# Altium project BottomBoard.PrjPcb
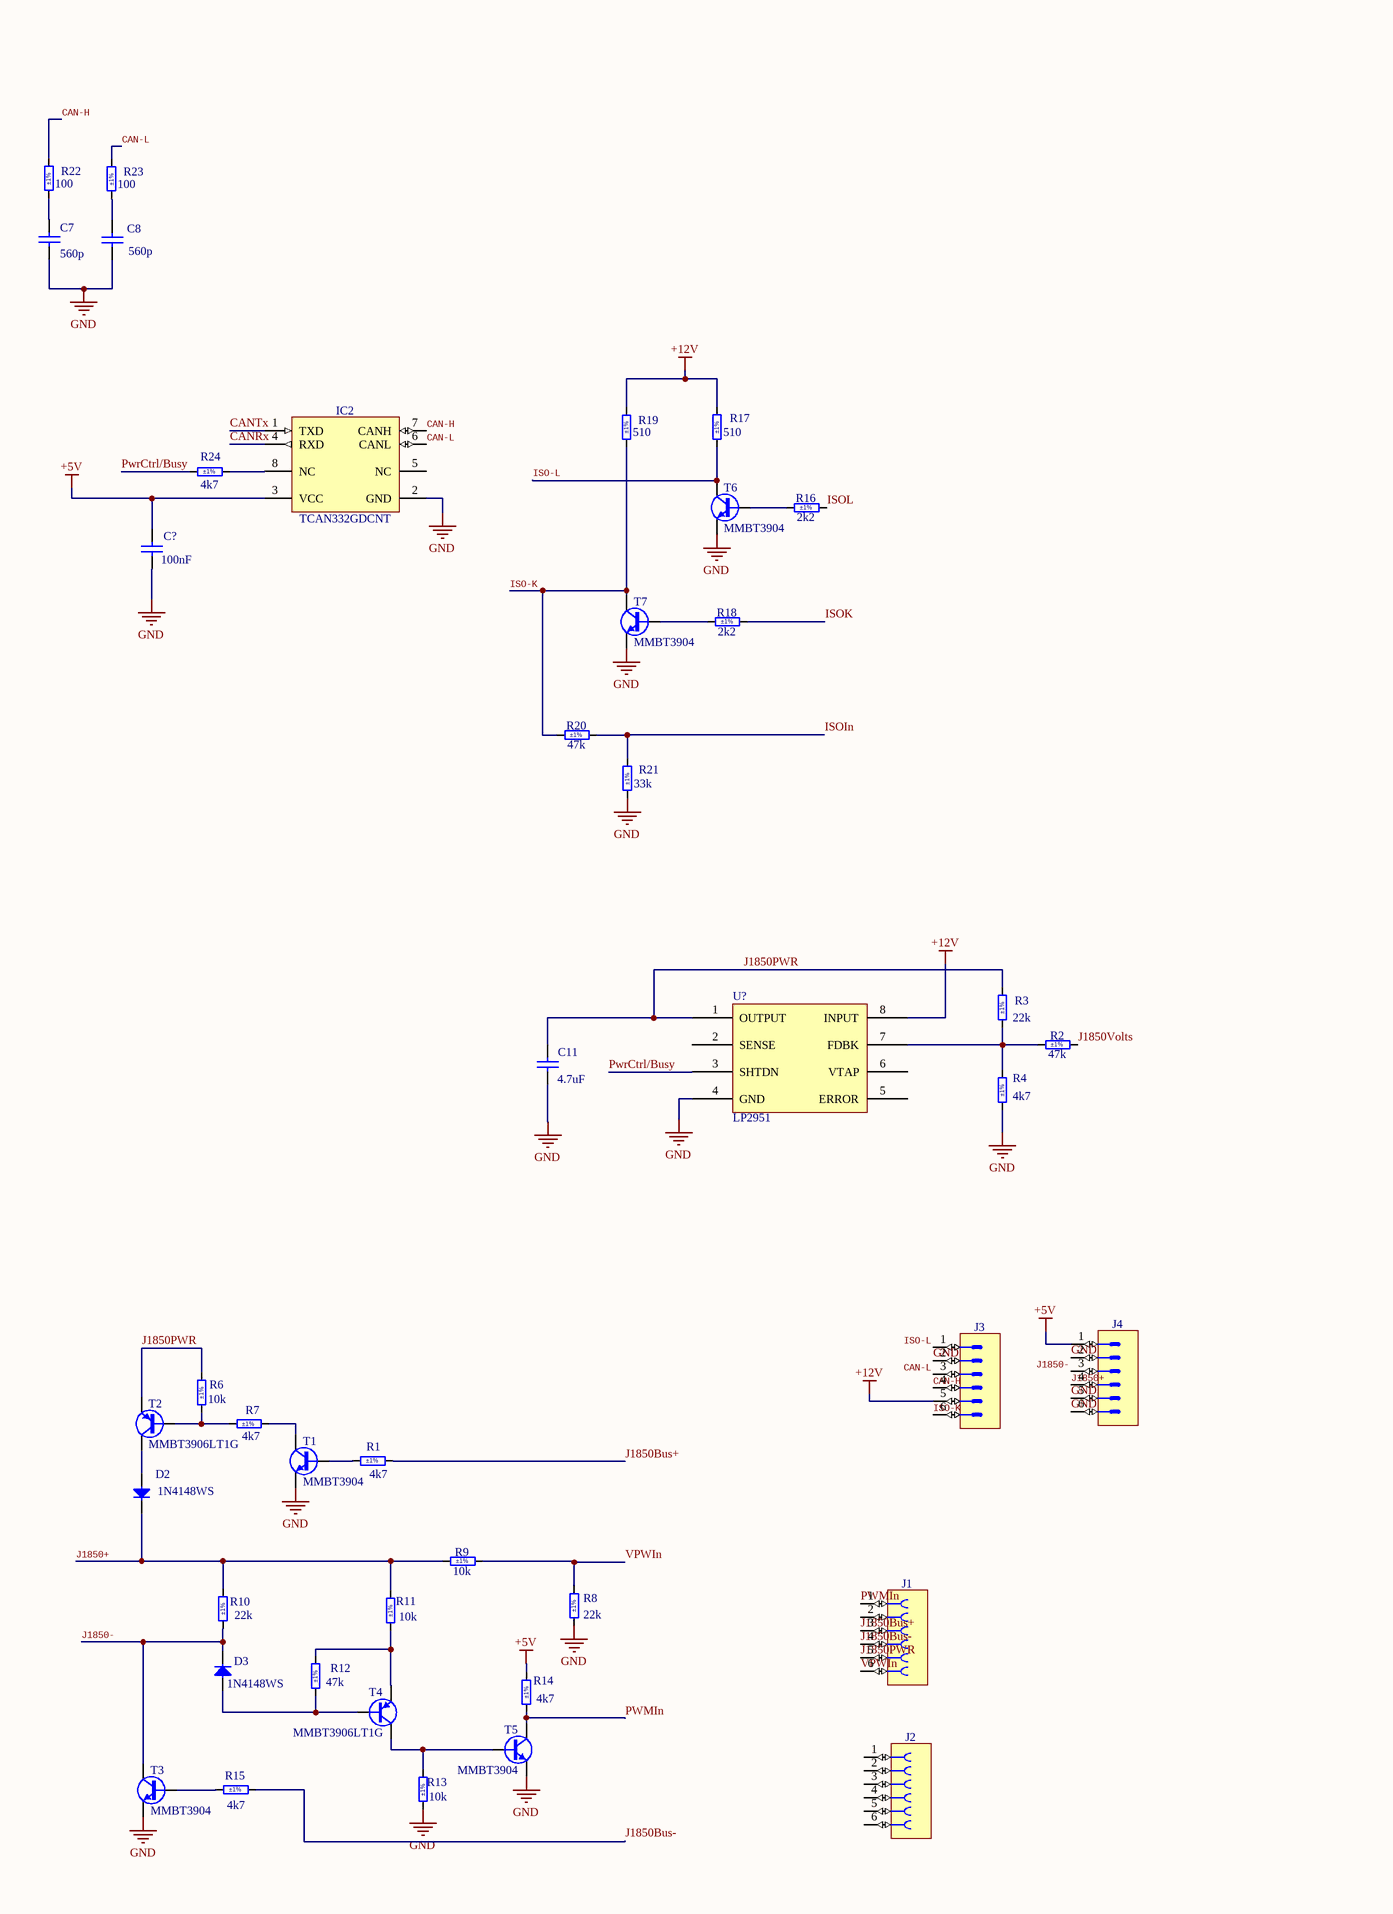
[diagram p0: BottomBoard.SchDoc]
2 sheets, 57 parts. Net scope: global (net labels, ports and power ports of the same name join across sheets).
Board file: BottomBoard.PcbDoc
Sheets:
  BottomBoard.SchDoc
  CPU.SchDoc

## Sheet BottomBoard.SchDoc
size 260 x 358 mm; Origin: Eagle; OriginPath: C:\Users\Bimbo\Downloads\ELM327-based OBD-II interface.sch; OriginSheet: 1

### Parts
(Parts that share a designator on the sheet are numbered #1, #2 ... from top to bottom, then left to right.)
C7  560p  [CAPC2012X135N]
C8  560p  [CAPC2012X135N]
C11  4.7uF  [CAPC2012X145N]
C?#1  100nF  [CAPC2012X135N]
D2  1N4148WS  [SODFL2512X100N]
D3  1N4148WS  [SODFL2512X100N]
IC2  TCAN332GDCNT  [SOT65P280X145-8N]
J1  Socket 6  [3M_929974-01-06-RK]  (value not drawn)
J2  Socket 6  [3M_929974-01-06-RK]  (value not drawn)
J3  Header 6  [3M_961106-6404-AR]  (value not drawn)
J4  Header 6  [3M_961106-6404-AR]  (value not drawn)
R1  4k7  Tolerance: ±1%  [RESC2012X60N]
R2  47k  Tolerance: ±1%  [RESC2012X60N]
R3  22k  Tolerance: ±1%  [RESC2012X60N]
R4  4k7  Tolerance: ±1%  [RESC2012X60N]
R6  10k  Tolerance: ±1%  [RESC2012X60N]
R7  4k7  Tolerance: ±1%  [RESC2012X60N]
R8  22k  Tolerance: ±1%  [RESC2012X60N]
R9  10k  Tolerance: ±1%  [RESC2012X60N]
R10  22k  Tolerance: ±1%  [RESC2012X60N]
R11  10k  Tolerance: ±1%  [RESC2012X60N]
R12  47k  Tolerance: ±1%  [RESC2012X60N]
R13  10k  Tolerance: ±1%  [RESC2012X60N]
R14  4k7  Tolerance: ±1%  [RESC2012X60N]
R15  4k7  Tolerance: ±1%  [RESC2012X60N]
R16  2k2  Tolerance: ±1%  [RESC2012X60N]
R17  510  Tolerance: ±1%  [RESC2012X60N]
R18  2k2  Tolerance: ±1%  [RESC2012X60N]
R19  510  Tolerance: ±1%  [RESC2012X60N]
R20  47k  Tolerance: ±1%  [RESC2012X60N]
R21  33k  Tolerance: ±1%  [RESC2012X60N]
R22  100  Tolerance: ±1%  [RESC2012X60N]
R23  100  Tolerance: ±1%  [RESC2012X60N]
R24  4k7  Tolerance: ±1%  [RESC2012X60N]
T1  MMBT3904  [SOT95P230X110-3N]
T2  MMBT3906LT1G  [SOT95P240X110-3N]
T3  MMBT3904  [SOT95P230X110-3N]
T4  MMBT3906LT1G  [SOT95P240X110-3N]
T5  MMBT3904  [SOT95P230X110-3N]
T6  MMBT3904  [SOT95P230X110-3N]
T7  MMBT3904  [SOT95P230X110-3N]
U?#1  LP2951  [25Q64]

### Nets
+5V: C?#1.2 IC2.3(VCC) J4.1 R14.2
+12V: J3.5 R17.2 R19.2 U?#1.8(INPUT)
GND: C7.1 C8.1 C11.1 C?#1.1 IC2.2(GND) J3.2 J4.2 J4.5 J4.6 R4.1 R8.1 R13.1 R21.1 T1.2(E) T3.2(E) T5.2(E) T6.2(E) T7.2(E) U?#1.4(GND)
CAN-H: IC2.7(CANH) J3.4 R22.2
CAN-L: IC2.6(CANL) J3.3 R23.2
CANRx: IC2.4(RXD)
CANTx: IC2.1(TXD)
ISO-K: J3.6 R19.1 R20.1 T7.3(C)
ISO-L: J3.1 R17.1 T6.3(C)
ISOIn: R20.2 R21.2
ISOK: R18.2
ISOL: R16.2
J1850+: D2.1(C) J4.4 R9.1 R10.2 R11.2
J1850-: D3.1(C) J4.3 R10.1 T3.3(C)
J1850Bus+: J1.3 R1.2
J1850Bus-: J1.4 R15.2
J1850PWR: C11.2 J1.5 R3.2 R6.2 T2.2(E) U?#1.1(OUTPUT)
J1850Volts: R2.2
PWMIn: J1.1 R14.1 T5.3(C)
PwrCtrl/Busy: R24.2 U?#1.3(SHTDN)
VPWIn: J1.6 R8.2 R9.2
NetC7_2: C7.2 R22.1
NetC8_2: C8.2 R23.1
NetD2_2: D2.2(A) T2.3(C)
NetD3_2: D3.2(A) R12.1 T4.1(B)
NetIC2_8: IC2.8(NC) R24.1
NetR1_1: R1.1 T1.1(B)
NetR2_1: R2.1 R3.1 R4.2 U?#1.7(FDBK)
NetR6_1: R6.1 R7.2 T2.1(B)
NetR7_1: R7.1 T1.3(C)
NetR11_1: R11.1 R12.2 T4.2(E)
NetR13_2: R13.2 T4.3(C) T5.1(B)
NetR15_1: R15.1 T3.1(B)
NetR16_1: R16.1 T6.1(B)
NetR18_1: R18.1 T7.1(B)

Not connected (* = marked no-connect by the designer): IC2 5(NC); J1 2; J2 1 2 3 4 5 6; U?#1 2(SENSE) 5(ERROR) 6(VTAP)

### Library data of the parts
C7 C8 C?#1 = CC0805_100NF_50V_10%_X7R: Non-polarised capacitor; Part Description: SMD Multilayer Chip Ceramic Capacitor; Manufacturer: GENERIC; Manufacturer1 Part Number: C2012X7R1H104K085; Voltage: 50V; TC: X7R; Tolerance: ±10%; Part Number: CC0805_100NF_50V_10%_X7R; Component Kind: Standard; Component Type: Standard; Pin Count: 2; Status: Preferred; Manufacturer Part Number: CC0805_100NF_50V_10%_X7R; Case: 0805; Mounted: Yes; Socket: No; SMD: Yes; Sense: No; Manufacturer1 Example: TDK; Manufacturer1 ComponentHeight: 1mm; HelpURL: \\cern.ch\dfs\Applications\Altium\Datasheets\CC0805_X7R_TDK_C.pdf; Author: CERN DEM JLC; CreateDate: 03.12.2007; LatestRevisionDate: 22.04.2015
  C7 C8: Value: 560p
  C?#1: Value: 100nF
C11 = CC0805_4.7UF_50V_10%_X7R: Non-polarised capacitor; Part Description: SMD Multilayer Chip Ceramic Capacitor; Manufacturer: GENERIC; Manufacturer1 Part Number: C2012X7R1H475K125; Voltage: 50V; TC: X7R; Tolerance: ±10%; Part Number: CC0805_4.7UF_50V_10%_X7R; Component Kind: Standard; Component Type: Standard; Pin Count: 2; Value: 4.7uF; Status: Preferred; Manufacturer Part Number: CC0805_4.7UF_50V_10%_X7R; Case: 0805; Mounted: Yes; Socket: No; SMD: Yes; Sense: No; Manufacturer1 Example: TDK; Manufacturer1 ComponentHeight: 1.45mm; HelpURL: \\cern.ch\dfs\Applications\Altium\Datasheets\CC0805_X7R_TDK_C.pdf; Author: CERN DEM JMW; CreateDate: 30.07.2021; LatestRevisionDate: 30.07.2021
D2 D3 = 1N4148WS: Diode; Part Description: Small Signal Diodes; Manufacturer: FAIRCHILD SEMICONDUCTOR; Voltage: 75V; Power: 150mA; PressFit: No; Bonding: No; Part Number: 1N4148WS; Component Kind: Standard; Component Type: Standard; Device: 1N4148WS; PackageDescription: SODFL Diode (SOD323F); 1.70mm W X 1.25mm L X 1.00mm H body, IPC Medium Density; Manufacturer Part Number: 1N4148WS; Pin Count: 2; Case: SOD-323F; Mounted: Yes; Socket: No; SMD: Yes; Sense: No; ComponentHeight: 1mm; HelpURL: \\cern.ch\dfs\Applications\Altium\Datasheets\1N4148WS.pdf; Author: CERN DEM JLC; CreateDate: 12.05.2011; LatestRevisionDate: 12.05.2011
IC2 = TCAN332GDCNT: 3.3V CAN Transceivers with CAN FD (Flexible Data Rate); Manufacturer: TEXAS INSTRUMENTS; PressFit: No; Bonding: No; Part Number: TCAN332GDCNT; Component Kind: Standard; Component Type: Standard; Device: TCAN332GDCNT; PackageDescription: SOT, 0.65mm Pitch; 8 pin, 1.625mm W X 2.90mm L X 1.45mm H body, IPC Medium Density; Part Description: 3.3V CAN Transceivers with CAN FD (Flexible Data Rate); Manufacturer Part Number: TCAN332GDCNT; Pin Count: 8; Case: SOT23-8; Mounted: Yes; Socket: No; SMD: Yes; Sense: No; ComponentHeight: 1.45mm; Author: CERN DEM JLC; HelpURL: \\cern.ch\dfs\Applications\Altium\Datasheets\TCAN332GDCNT.pdf; CreateDate: 22.08.2017; LatestRevisionDate: 22.08.2017
J1 J2 = 3M_929974-01-06-RK: Connector 6 Female; Part Description: 6 Contacts, Straight .100" x .100" Boardmount Socket, 929 Series; Manufacturer: 3M; PressFit: No; Part Number: 3M_929974-01-06-RK; Component Kind: Standard; Component Type: Standard; Pin Count: 6; Family: Socket 6; Mounted: Yes; Socket: No; SMD: No; Sense: No; Status: None; Manufacturer Part Number: 929974-01-06-RK; ComponentHeight: 8.26mm; HelpURL: \\cern.ch\dfs\Applications\Altium\Datasheets\3M_929974-01-06-RK.pdf; Author: CERN DEM JMW; CreateDate: 31.08.2016; LatestRevisionDate: 31.08.2016
J3 J4 = 3M_961106-6404-AR: Connector 6 Male; Part Description: 6 Contacts, Straight .100" x .100" Pin Strip Header, 961 Series; Manufacturer: 3M; PressFit: No; Part Number: 3M_961106-6404-AR; Component Kind: Standard; Component Type: Standard; Pin Count: 6; Family: Header 6; Mounted: Yes; Socket: No; SMD: No; Sense: No; Status: None; Manufacturer Part Number: 961106-6404-AR; ComponentHeight: 8mm; HelpURL: \\cern.ch\dfs\Applications\Altium\Datasheets\3M_961106-6404-AR.pdf; Author: CERN DEM MR; CreateDate: 05.09.2016; LatestRevisionDate: 05.09.2016
R1 R4 R7 R12 R14 R15 R24 = R0805_4K7_1%_0.125W_100PPM: Resistor - 1%; Part Description: General Purpose Thick Film Chip Resistor; Manufacturer: GENERIC; Manufacturer1 Part Number: NRC10F4701TRF; Power: 0.125W; TC: ±100ppm/°C; PressFit: No; Part Number: R0805_4K7_1%_0.125W_100PPM; Component Kind: Standard; Component Type: Standard; Pin Count: 2; Status: Preferred; Manufacturer Part Number: R0805_4K7_1%_0.125W_100PPM; Case: 0805; Mounted: Yes; Sense: No; Socket: No; SMD: Yes; Manufacturer1 Example: NIC COMPONENT; Manufacturer1 ComponentHeight: 0.6mm; HelpURL: \\cern.ch\dfs\Applications\Altium\Datasheets\R0805_NIC_NRC.pdf; Author: CERN DEM JLC; CreateDate: 03.12.2007; LatestRevisionDate: 13.03.2008
  R1 R4 R7 R14 R15 R24: Value: 4k7
  R12: Value: 47k
R2 = R0805_47K_1%_0.125W_100PPM: Resistor - 1%; Part Description: General Purpose Thick Film Chip Resistor; Manufacturer: GENERIC; Manufacturer1 Part Number: NRC10F4702TRF; Power: 0.125W; TC: ±100ppm/°C; PressFit: No; Part Number: R0805_47K_1%_0.125W_100PPM; Component Kind: Standard; Component Type: Standard; Pin Count: 2; Value: 47k; Status: Preferred; Manufacturer Part Number: R0805_47K_1%_0.125W_100PPM; Case: 0805; Mounted: Yes; Sense: No; Socket: No; SMD: Yes; Manufacturer1 Example: NIC COMPONENT; Manufacturer1 ComponentHeight: 0.6mm; HelpURL: \\cern.ch\dfs\Applications\Altium\Datasheets\R0805_NIC_NRC.pdf; Author: CERN DEM JLC; CreateDate: 03.12.2007; LatestRevisionDate: 13.03.2008
R3 = R0805_22K_1%_0.125W_100PPM: Resistor - 1%; Part Description: General Purpose Thick Film Chip Resistor; Manufacturer: GENERIC; Manufacturer1 Part Number: NRC10F2202TRF; Power: 0.125W; TC: ±100ppm/°C; PressFit: No; Part Number: R0805_22K_1%_0.125W_100PPM; Component Kind: Standard; Component Type: Standard; Pin Count: 2; Value: 22k; Status: Preferred; Manufacturer Part Number: R0805_22K_1%_0.125W_100PPM; Case: 0805; Mounted: Yes; Sense: No; Socket: No; SMD: Yes; Manufacturer1 Example: NIC COMPONENT; Manufacturer1 ComponentHeight: 0.6mm; HelpURL: \\cern.ch\dfs\Applications\Altium\Datasheets\R0805_NIC_NRC.pdf; Author: CERN DEM JLC; CreateDate: 03.12.2007; LatestRevisionDate: 13.03.2008
R6 R9 R11 R13 = R0805_10K_1%_0.125W_100PPM: Resistor - 1%; Part Description: General Purpose Thick Film Chip Resistor; Manufacturer: GENERIC; Manufacturer1 Part Number: NRC10F1002TRF; Power: 0.125W; TC: ±100ppm/°C; PressFit: No; Part Number: R0805_10K_1%_0.125W_100PPM; Component Kind: Standard; Component Type: Standard; Pin Count: 2; Value: 10k; Status: Preferred; Manufacturer Part Number: R0805_10K_1%_0.125W_100PPM; Case: 0805; Mounted: Yes; Sense: No; Socket: No; SMD: Yes; Manufacturer1 Example: NIC COMPONENT; Manufacturer1 ComponentHeight: 0.6mm; HelpURL: \\cern.ch\dfs\Applications\Altium\Datasheets\R0805_NIC_NRC.pdf; Author: CERN DEM JLC; CreateDate: 03.12.2007; LatestRevisionDate: 13.03.2008
R8 R10 R16-R23 = R0805_2K2_1%_0.125W_100PPM: Resistor - 1%; Part Description: General Purpose Thick Film Chip Resistor; Manufacturer: GENERIC; Manufacturer1 Part Number: NRC10F2201TRF; Power: 0.125W; TC: ±100ppm/°C; PressFit: No; Part Number: R0805_2K2_1%_0.125W_100PPM; Component Kind: Standard; Component Type: Standard; Pin Count: 2; Status: Preferred; Manufacturer Part Number: R0805_2K2_1%_0.125W_100PPM; Case: 0805; Mounted: Yes; Sense: No; Socket: No; SMD: Yes; Manufacturer1 Example: NIC COMPONENT; Manufacturer1 ComponentHeight: 0.6mm; HelpURL: \\cern.ch\dfs\Applications\Altium\Datasheets\R0805_NIC_NRC.pdf; Author: CERN DEM JLC; CreateDate: 03.12.2007; LatestRevisionDate: 13.03.2008
  R8 R10: Value: 22k
  R16 R18: Value: 2k2
  R17 R19: Value: 510
  R20: Value: 47k
  R21: Value: 33k
  R22 R23: Value: 100
T1 T3 T5-T7 = MMBT3904: NPN Transistor; Part Description: 40V 200mA NPN Switching Transistor; Manufacturer: NEXPERIA; PressFit: No; Bonding: No; Part Number: MMBT3904; Component Kind: Standard; Component Type: Standard; Device: MMBT3904; PackageDescription: SOT23, 0.95mm Pitch; 3 Pin, 1.30mm W X 2.90mm L X 1.10mm H body, IPC Medium Density; Manufacturer Part Number: MMBT3904; Pin Count: 3; Case: SOT23-3; Mounted: Yes; Socket: No; SMD: Yes; Sense: No; ComponentHeight: 1.1mm; HelpURL: \\cern.ch\dfs\Applications\Altium\Datasheets\MMBT3904.pdf; Author: CERN DEM JLC; CreateDate: 10.02.2010; LatestRevisionDate: 16.09.2021
T2 T4 = MMBT3906LT1G: PNP Transistor; Part Description: 40V 200mA PNP General Purpose Transistor; Manufacturer: ON SEMICONDUCTOR; PressFit: No; Bonding: No; Part Number: MMBT3906LT1G; Component Kind: Standard; Component Type: Standard; Device: MMBT3906LT1G; PackageDescription: SOT23, 0.95mm Pitch; 3 Pin, 1.40mm W X 3.00mm L X 1.10mm H body, IPC Medium Density; Manufacturer Part Number: MMBT3906LT1G; Pin Count: 3; Case: SOT23-3; Mounted: Yes; Socket: No; SMD: Yes; Sense: No; ComponentHeight: 1.1mm; HelpURL: \\cern.ch\dfs\Applications\Altium\Datasheets\MMBT3906LT1G.pdf; Author: CERN DEM JLC; CreateDate: 29.03.2012; LatestRevisionDate: 29.03.2012

## Sheet CPU.SchDoc
size A4
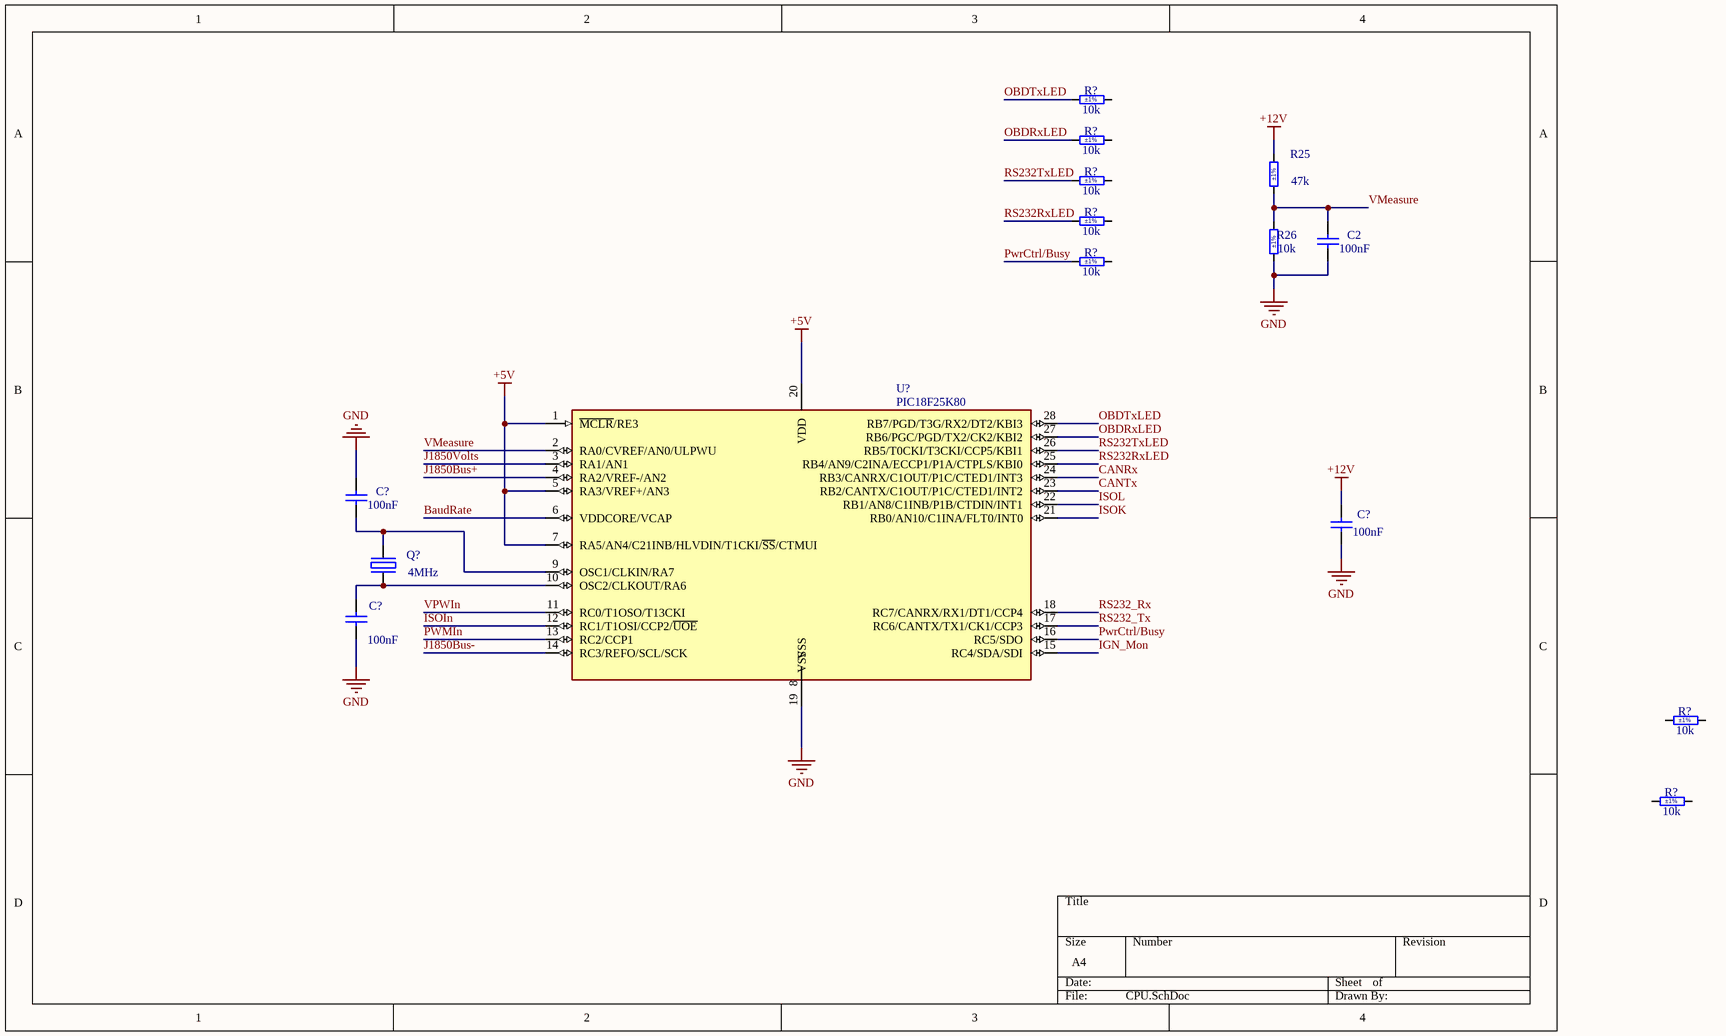
[diagram p1: CPU.SchDoc]

### Parts
(Parts that share a designator on the sheet are numbered #1, #2 ... from top to bottom, then left to right.)
C2  100nF  [CAPC2012X135N]
C?#2  100nF  [CAPC2012X135N]
C?#3  100nF  [CAPC2012X135N]
C?#4  100nF  [CAPC2012X135N]
Q?  4MHz  [XTAL1160X490X430]
R25  47k  Tolerance: ±1%  [RESC2012X60N]
R26  10k  Tolerance: ±1%  [RESC2012X60N]
R?#1  10k  Tolerance: ±1%  [RESC2012X60N]
R?#2  10k  Tolerance: ±1%  [RESC2012X60N]
R?#3  10k  Tolerance: ±1%  [RESC2012X60N]
R?#4  10k  Tolerance: ±1%  [RESC2012X60N]
R?#5  10k  Tolerance: ±1%  [RESC2012X60N]
R?#6  10k  Tolerance: ±1%  [RESC2012X60N]
R?#7  10k  Tolerance: ±1%  [RESC2012X60N]
U?#2  PIC18F25K80  [SOIC127P1032X265-28N]

### Nets
+5V: U?#2.1(~{MCLR}/RE3) U?#2.5(RA3/VREF+/AN3) U?#2.7(RA5/AN4/C21INB/HLVDIN/T1CKI/~{SS}/CTMUI) U?#2.20(VDD)
+12V: C?#3.2 R25.2
GND: C2.1 C?#2.2 C?#3.1 C?#4.1 R26.1 U?#2.19(VSS)
BaudRate: U?#2.6(VDDCORE/VCAP)
CANRx: U?#2.24(RB3/CANRX/C1OUT/P1C/CTED1/INT3)
CANTx: U?#2.23(RB2/CANTX/C1OUT/P1C/CTED1/INT2)
IGN_Mon: U?#2.15(RC4/SDA/SDI)
ISOIn: U?#2.12(RC1/T1OSI/CCP2/~{UOE})
ISOK: U?#2.21(RB0/AN10/C1INA/FLT0/INT0)
ISOL: U?#2.22(RB1/AN8/C1INB/P1B/CTDIN/INT1)
J1850Bus+: U?#2.4(RA2/VREF-/AN2)
J1850Bus-: U?#2.14(RC3/REFO/SCL/SCK)
J1850Volts: U?#2.3(RA1/AN1)
OBDRxLED: R?#2.1 U?#2.27(RB6/PGC/PGD/TX2/CK2/KBI2)
OBDTxLED: R?#1.1 U?#2.28(RB7/PGD/T3G/RX2/DT2/KBI3)
PWMIn: U?#2.13(RC2/CCP1)
PwrCtrl/Busy: R?#5.1 U?#2.16(RC5/SDO)
RS232_Rx: U?#2.18(RC7/CANRX/RX1/DT1/CCP4)
RS232_Tx: U?#2.17(RC6/CANTX/TX1/CK1/CCP3)
RS232RxLED: R?#4.1 U?#2.25(RB4/AN9/C2INA/ECCP1/P1A/CTPLS/KBI0)
RS232TxLED: R?#3.1 U?#2.26(RB5/T0CKI/T3CKI/CCP5/KBI1)
VMeasure: C2.2 R25.1 R26.2 U?#2.2(RA0/CVREF/AN0/ULPWU)
VPWIn: U?#2.11(RC0/T1OSO/T13CKI)
NetC?#2_1: C?#2.1 Q?.2(OSC2) U?#2.9(OSC1/CLKIN/RA7)
NetC?#4_2: C?#4.2 Q?.1(OSC1) U?#2.10(OSC2/CLKOUT/RA6)

Not connected (* = marked no-connect by the designer): R?#1 2; R?#2 2; R?#3 2; R?#4 2; R?#5 2; R?#6 1 2; R?#7 1 2; U?#2 8(VSS)

### Library data of the parts
C2 C?#2-C?#4 = CC0805_100NF_50V_10%_X7R: as C7 on sheet BottomBoard; Part Number: CC0805_100NF_50V_10%_X7R; Component Kind: Standard; Component Type: Standard; Pin Count: 2; Value: 100nF; Status: Preferred; Manufacturer Part Number: CC0805_100NF_50V_10%_X7R; Case: 0805; Mounted: Yes; Socket: No; SMD: Yes; Sense: No; Manufacturer1 Example: TDK; Manufacturer1 ComponentHeight: 1mm; HelpURL: \\cern.ch\dfs\Applications\Altium\Datasheets\CC0805_X7R_TDK_C.pdf; Author: CERN DEM JLC; CreateDate: 03.12.2007; LatestRevisionDate: 22.04.2015
Q? = XTAL_40MHZ_IQD_LFXTAL033584: Quartz Crystal; Part Description: Tolerance: ± 30ppm, Stability: ± 50ppm, -10°C to +66°C, 18pF, Surface Mount Quartz Crystal, HC49/4HSMX Series; Manufacturer: IQD FREQUENCY PRODUCTS; PressFit: No; Bonding: No; Part Number: XTAL_40MHZ_IQD_LFXTAL033584; Component Kind: Standard; Component Type: Standard; PackageDescription: HC-49/4HSMX Case, SMD Crystal; 2 Pins, Body 11.6mm L X 4.90mm W X 4.30mm H; Value: 4MHz; Manufacturer Part Number: LF XTAL033584; Pin Count: 2; Mounted: Yes; Socket: No; SMD: Yes; Sense: No; ComponentHeight: 4.3mm; HelpURL: \\cern.ch\dfs\Applications\Altium\Datasheets\XTAL_IQD_HC49-4HSMX.pdf; Author: CERN DEM JLC; CreateDate: 02.04.2012; LatestRevisionDate: 07.11.2016
R25 R26 R?#1-R?#7 = R0805_10K_1%_0.125W_100PPM: as R6 on sheet BottomBoard; Part Number: R0805_10K_1%_0.125W_100PPM; Component Kind: Standard; Component Type: Standard; Pin Count: 2; Status: Preferred; Manufacturer Part Number: R0805_10K_1%_0.125W_100PPM; Case: 0805; Mounted: Yes; Sense: No; Socket: No; SMD: Yes; Manufacturer1 Example: NIC COMPONENT; Manufacturer1 ComponentHeight: 0.6mm; HelpURL: \\cern.ch\dfs\Applications\Altium\Datasheets\R0805_NIC_NRC.pdf; Author: CERN DEM JLC; CreateDate: 03.12.2007; LatestRevisionDate: 13.03.2008
  R25: Value: 47k
  R26 R?#1-R?#7: Value: 10k
U?#2 = PIC18F25K80: PIC PICÂ® XLPâ„¢ 18K Microcontroller IC 8-Bit 64MHz 32KB (16K x 16) FLASH 28-QFN-S (6x6); MF: Microchip; SnapEDA_Link: https://www.snapeda.com/parts/PIC18F25K80/Microchip/view-part/?ref=snap; Package: QFN-28 Microchip; Value: *; MP: PIC18F25K80; Check_prices: https://www.snapeda.com/parts/PIC18F25K80/Microchip/view-part/?ref=eda

## Nets that join several sheets
+5V: BottomBoard (C?#1.2 IC2.3 J4.1 R14.2), CPU (U?#2.1 U?#2.5 U?#2.7 U?#2.20)
+12V: BottomBoard (J3.5 R17.2 R19.2 U?#1.8), CPU (C?#3.2 R25.2)
GND: BottomBoard (19 pins), CPU (6 pins)
CANRx: BottomBoard (IC2.4), CPU (U?#2.24)
CANTx: BottomBoard (IC2.1), CPU (U?#2.23)
ISOIn: BottomBoard (R20.2 R21.2), CPU (U?#2.12)
ISOK: BottomBoard (R18.2), CPU (U?#2.21)
ISOL: BottomBoard (R16.2), CPU (U?#2.22)
J1850Bus+: BottomBoard (J1.3 R1.2), CPU (U?#2.4)
J1850Bus-: BottomBoard (J1.4 R15.2), CPU (U?#2.14)
J1850Volts: BottomBoard (R2.2), CPU (U?#2.3)
PWMIn: BottomBoard (J1.1 R14.1 T5.3), CPU (U?#2.13)
PwrCtrl/Busy: BottomBoard (R24.2 U?#1.3), CPU (R?#5.1 U?#2.16)
VPWIn: BottomBoard (J1.6 R8.2 R9.2), CPU (U?#2.11)